# Altium schematic sheet Lichtsensor.SchDoc: SysP17_Team10: Lichtsensor
size A4; Author: N. Dürr / M.Mettler; CompanyName: NTB; Organization: NTB Interstate University of Applied; Address1: Werdenbergstrasse 4; Address3: 9471 Buchs; Address4: Switzerland; Organization1: Sciences of Technology Buchs; Size: A4; ShortDescription: Schema der Lichtsensoren-Schaltung
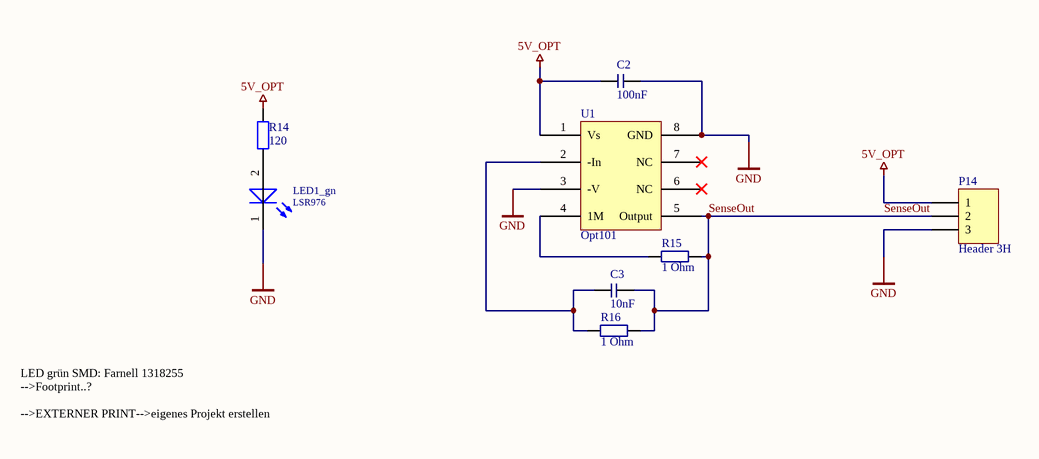
[diagram p0: Lichtsensor.SchDoc]

## Parts
C2  100nF  [1206]
C3  10nF  [1206]
LED1_gn  LSR976  [GEN_LED0805_1K2A_2_H]
P14  Header 3H  [HDR1X3H]
R14  value 120  [GEN_R0805_H]  (hidden comment: Generic)
R15  1 Ohm  [1206]
R16  1 Ohm  [1206]
U1  Opt101  [Opt101]

## Nets
5V_OPT: C2.1 P14.1 R14.2 U1.1(Vs)
GND: C2.2 LED1_gn.1(K) P14.3 U1.3(-V) U1.8(GND)
SenseOut: C3.2 P14.2 R15.2 R16.2 U1.5(Output)
NetC3_1: C3.1 R16.1 U1.2(-In)
NetLED1_gn_2: LED1_gn.2(A) R14.1
NetR15_1: R15.1 U1.4(1M)

Not connected (* = marked no-connect by the designer): U1 6(NC)* 7(NC)*

## Notes on the sheet
- LED grün SMD: Farnell 1318255
  -->Footprint..?
  -->EXTERNER PRINT-->eigenes Projekt erstellen
- Title:
- Description:
- Size:
- Date:
- Name:
- Number:
- Time:
- Revision:
- Sheet
- Checked:
- of
- File:

## Library data of the parts
C2 C3 = C1206
  C2: Value: 100nF
  C3: Value: 10nF
LED1_gn = OSR_LSR976_0805(1K2A): Hyper ChipLED, Red,; Manufacturer: OSRAM; #Class: DIODE; #ClassSub: LED; ComponentLink1Description: Manufacturer Link; ComponentLink1URL: http://www.osram-os.com/osram_os/en/products/product-catalog/led-light-emitting-diodes/chipled/chipled-0805/ls-r976/index.jsp?search_result=%2fosram_os%2fen%2fsearch%2fadvanced_search.jsp%3faction%3ddosearch%26inp_searchterm_1%3dLS%2bR976%26website_name%3dosram_os_en; ComponentLink2Description: Datasheet; ComponentLink2URL: http://catalog.osram-os.com/catalogue/catalogue.do;jsessionid=8A0FA5146E77D3A917A5A5D383CD44B4?act=downloadFile&favOid=0200000600039319000100b6; ComponentLink3Description: Packaging Specification; ComponentLink3URL: http://catalog.osram-os.com/catalogue/catalogue.do;jsessionid=8A0FA5146E77D3A917A5A5D383CD44B4?act=downloadFile&favOid=0200000600039319000100b6; Distributor: Farnell; RefFootprint: GEN_LED0805_1K2A_2_H; Manufacturer PartNr: LSR976; Distributor PartNr: 1226392; Published: 20121218; Publisher: Stefan Ursella, M.Eng; RefFileFOO: *; RefFileSCH: *; RefSchema: OSR_LSR976_0805(1K2A)
P14 = Header 3H: Header, 3-Pin, Right Angle; LatestRevisionDate: 17-Jul-2002; LatestRevisionNote: Re-released for DXP Platform.; Publisher: Altium Limited
R14 = GEN_R_2: generic resistor; Manufacturer: Tbd; #Class: PASSIVE; Published: 8-Jun-2000; Publisher: Altium Limited; #ClassSub: RESISTOR; ComponentLink1Description: Manufacturer Link; ComponentLink2Description: Datasheet; ComponentLink3Description: Packaging Specification; Distributor: tbd; RefFootprint: GEN_R0805_H; Manufacturer PartNr: tbd; Distributor PartNr: tbd; RefFileFOO: *; RefFileSCH: *; RefSchema: GEN_R_2
R15 R16 = R1206: Value: 1 Ohm